# EasyEDA Pro project ProPrj_SRC_Robot2025_V1.0_2026-09-06.epro, schematic Schematic-MOTORINT
Board Name: Motor_Interface; Create Date: 2026-02-08; Page Name: P1; Project Name: SRC_Robot2025_V1.0; Schematic Name: Schematic-MOTORINT; Update Date: 2026-02-09; Company: 嘉立创EDA; Page Size: A4; Version: V1.0
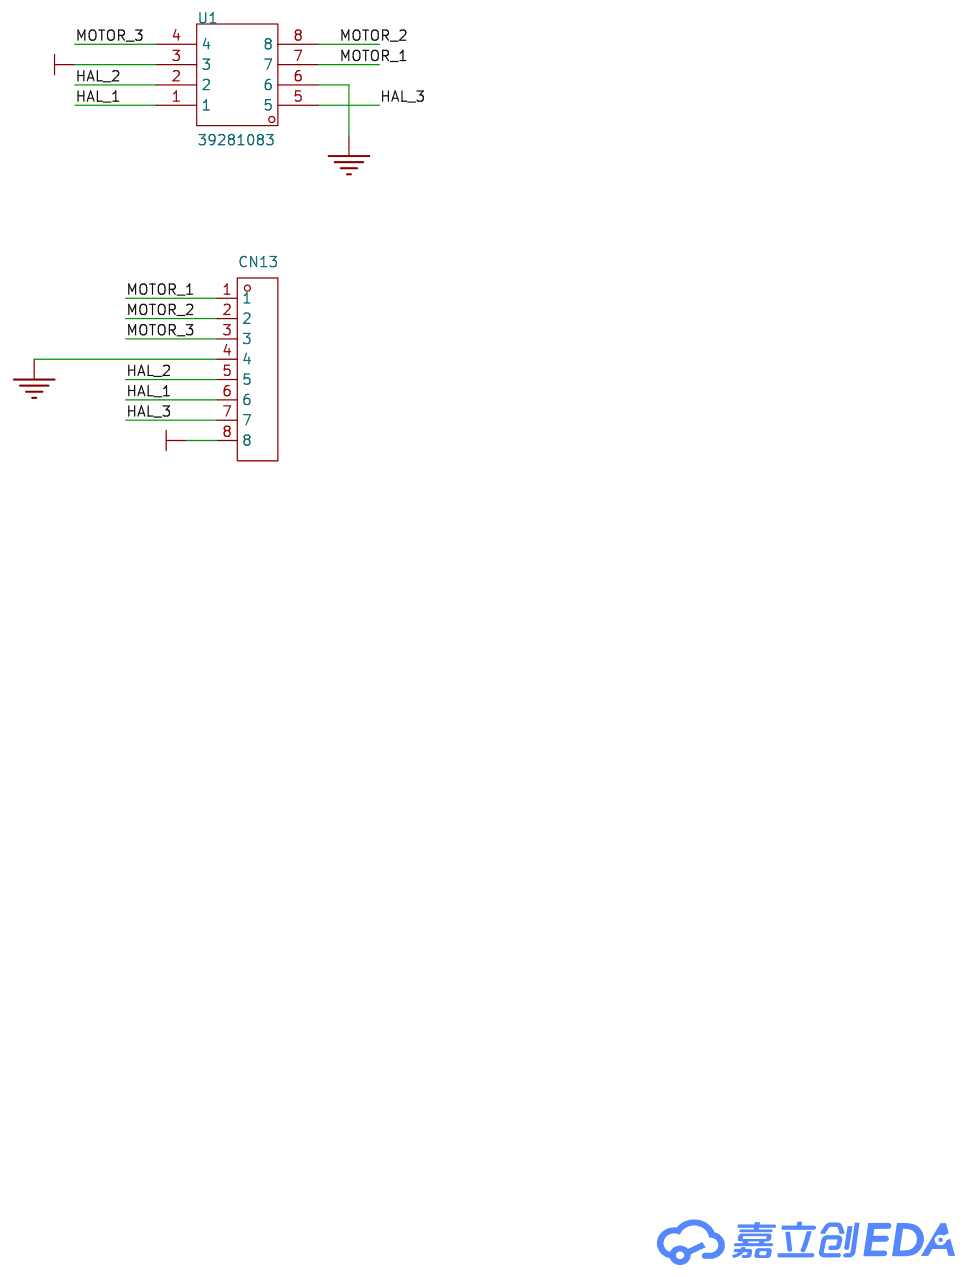
[diagram p9: schematic sheet]

## Parts
CN13  ZX-XH2.54-8PZZ  [CONN-TH_8P-P2.50-XH2.54-8P]
U1  39281083  [CONN-TH_39281083]

## Library data of the parts
CN13 = ZX-XH2.54-8PZZ: 插针结构:1x8P;间距:2.5mm;安装方式:直插;参考系列:XH;总PIN数:8P;排数:1;每排PIN数:8;行距:-;额定电流:3A;触头材质:黄铜;触头镀层:锡;工作温度:-25℃~+85℃;; LCSC Part Name: 1x8P 间距:2.5mm 直插 系列:XH; Supplier Part: C7429638; Manufacturer: Megastar(兆星); Supplier Footprint: 插件,P=2.5mm; JLCPCB Part Class: Extended Part; Datasheet: https://item.szlcsc.com/datasheet/ZX-XH2.54-8PZZ/8427555.html; Supplier: LCSC; Pins Structure: 1x8P; Pitch: 2.5mm; Mounting Type: 直插; Reference Series: XH; Number of Pins: 8P; Number of Rows: 1; Number of PINs Per Row: 8; Current Rating: 3A; Contact Material: 黄铜; Contact Plating: 锡; Operating Temperature: -25℃~+85℃; Voltage Rating: 250V; Plastic Material: PA66; Flame Retardant Rating: UL94V-0; Color: 白色; Z-Height of the Board: 7mm; X-Length of Bottom Edge on Board (Spacing Line): 22.5mm; Y-Width of Bottom Edge on Board: 5.9mm
U1 = 39281083: 插针结构:2x4P;间距:4.2mm;安装方式:弯插;参考系列:-;总PIN数:8P;排数:2;每排PIN数:4;行距:4.2mm;额定电流:9A;触头材质:黄铜;触头镀层:锡;工作温度:-40℃~+105℃;; LCSC Part Name: 2x4P 间距:4.2mm 弯插; Supplier Part: C293503; Manufacturer: MOLEX; Supplier Footprint: 插件,P=4.2mm; JLCPCB Part Class: 扩展库; Datasheet: https://www.molex.com/content/dam/molex/molex-dot-com/products/automated/en-us/salesdrawingpdf/556/5566/039281083_sd.pdf?inline\; Supplier: LCSC; Pins Structure: 2x4P; Pitch: 4.2mm; Mounting Type: 弯插; Number of Pins: 8P; Number of Rows: 2; Number of PINs Per Row: 4; Row Spacing: 4.2mm; Current Rating: 9A; Contact Material: 黄铜; Contact Plating: 锡; Operating Temperature: -40℃~+105℃; Voltage Rating: 600V; Plastic Material: PA; Flame Retardant Rating: UL94V-2; Color: 白色

## Nets
+5V: CN13.8 U1.3
GND: CN13.4 U1.6
HAL_1: CN13.6 U1.1
HAL_2: CN13.5 U1.2
HAL_3: CN13.7 U1.5
MOTOR_1: CN13.1 U1.7
MOTOR_2: CN13.2 U1.8
MOTOR_3: CN13.3 U1.4
